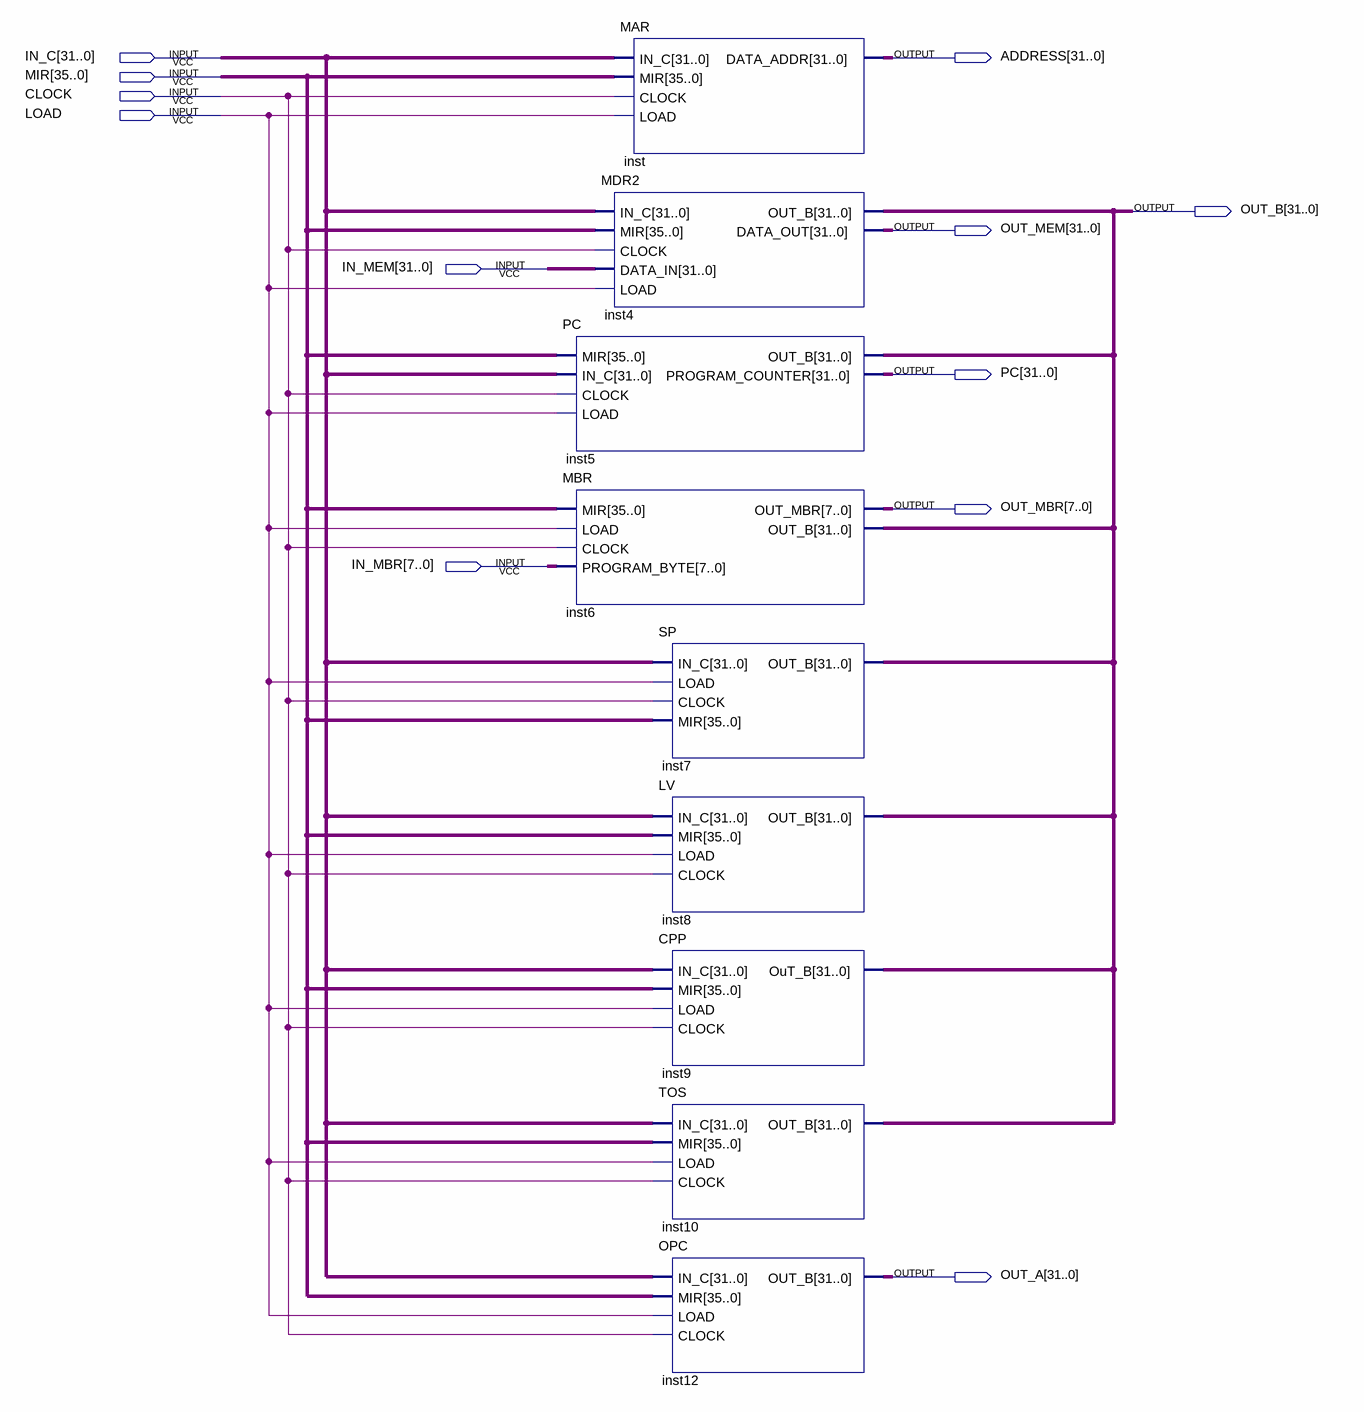
[diagram p0: schematic sheet]
// Quartus schematic REGISTER_BANK.bdf as structural Verilog: 9 symbols, 12 pins
module REGISTER_BANK (
  input  [31:0] IN_C,
  input  [35:0] MIR,
  input  CLOCK,
  input  LOAD,
  input  [31:0] IN_MEM,
  input  [7:0] IN_MBR,
  output [31:0] ADDRESS,
  output [31:0] OUT_B,
  output [31:0] OUT_MEM,
  output [31:0] PC,
  output [7:0] OUT_MBR,
  output [31:0] OUT_A
);

  PC inst5 (.MIR(MIR), .IN_C(IN_C), .CLOCK(CLOCK), .LOAD(LOAD), .OUT_B(OUT_B), .PROGRAM_COUNTER(PC));
  MBR inst6 (.MIR(MIR), .LOAD(LOAD), .CLOCK(CLOCK), .PROGRAM_BYTE(IN_MBR), .OUT_MBR(OUT_MBR), .OUT_B(OUT_B));
  MAR inst (.IN_C(IN_C), .MIR(MIR), .CLOCK(CLOCK), .LOAD(LOAD), .DATA_ADDR(ADDRESS));
  MDR2 inst4 (.IN_C(IN_C), .MIR(MIR), .CLOCK(CLOCK), .DATA_IN(IN_MEM), .LOAD(LOAD), .OUT_B(OUT_B), .DATA_OUT(OUT_MEM));
  SP inst7 (.IN_C(IN_C), .LOAD(LOAD), .CLOCK(CLOCK), .MIR(MIR), .OUT_B(OUT_B));
  LV inst8 (.IN_C(IN_C), .MIR(MIR), .LOAD(LOAD), .CLOCK(CLOCK), .OUT_B(OUT_B));
  CPP inst9 (.IN_C(IN_C), .MIR(MIR), .LOAD(LOAD), .CLOCK(CLOCK), .OuT_B(OUT_B));
  TOS inst10 (.IN_C(IN_C), .MIR(MIR), .LOAD(LOAD), .CLOCK(CLOCK), .OUT_B(OUT_B));
  OPC inst12 (.IN_C(IN_C), .MIR(MIR), .LOAD(LOAD), .CLOCK(CLOCK), .OUT_B(OUT_A));
endmodule
